# Altium project xDAC-v3.PrjPcb (part 1 of 7)
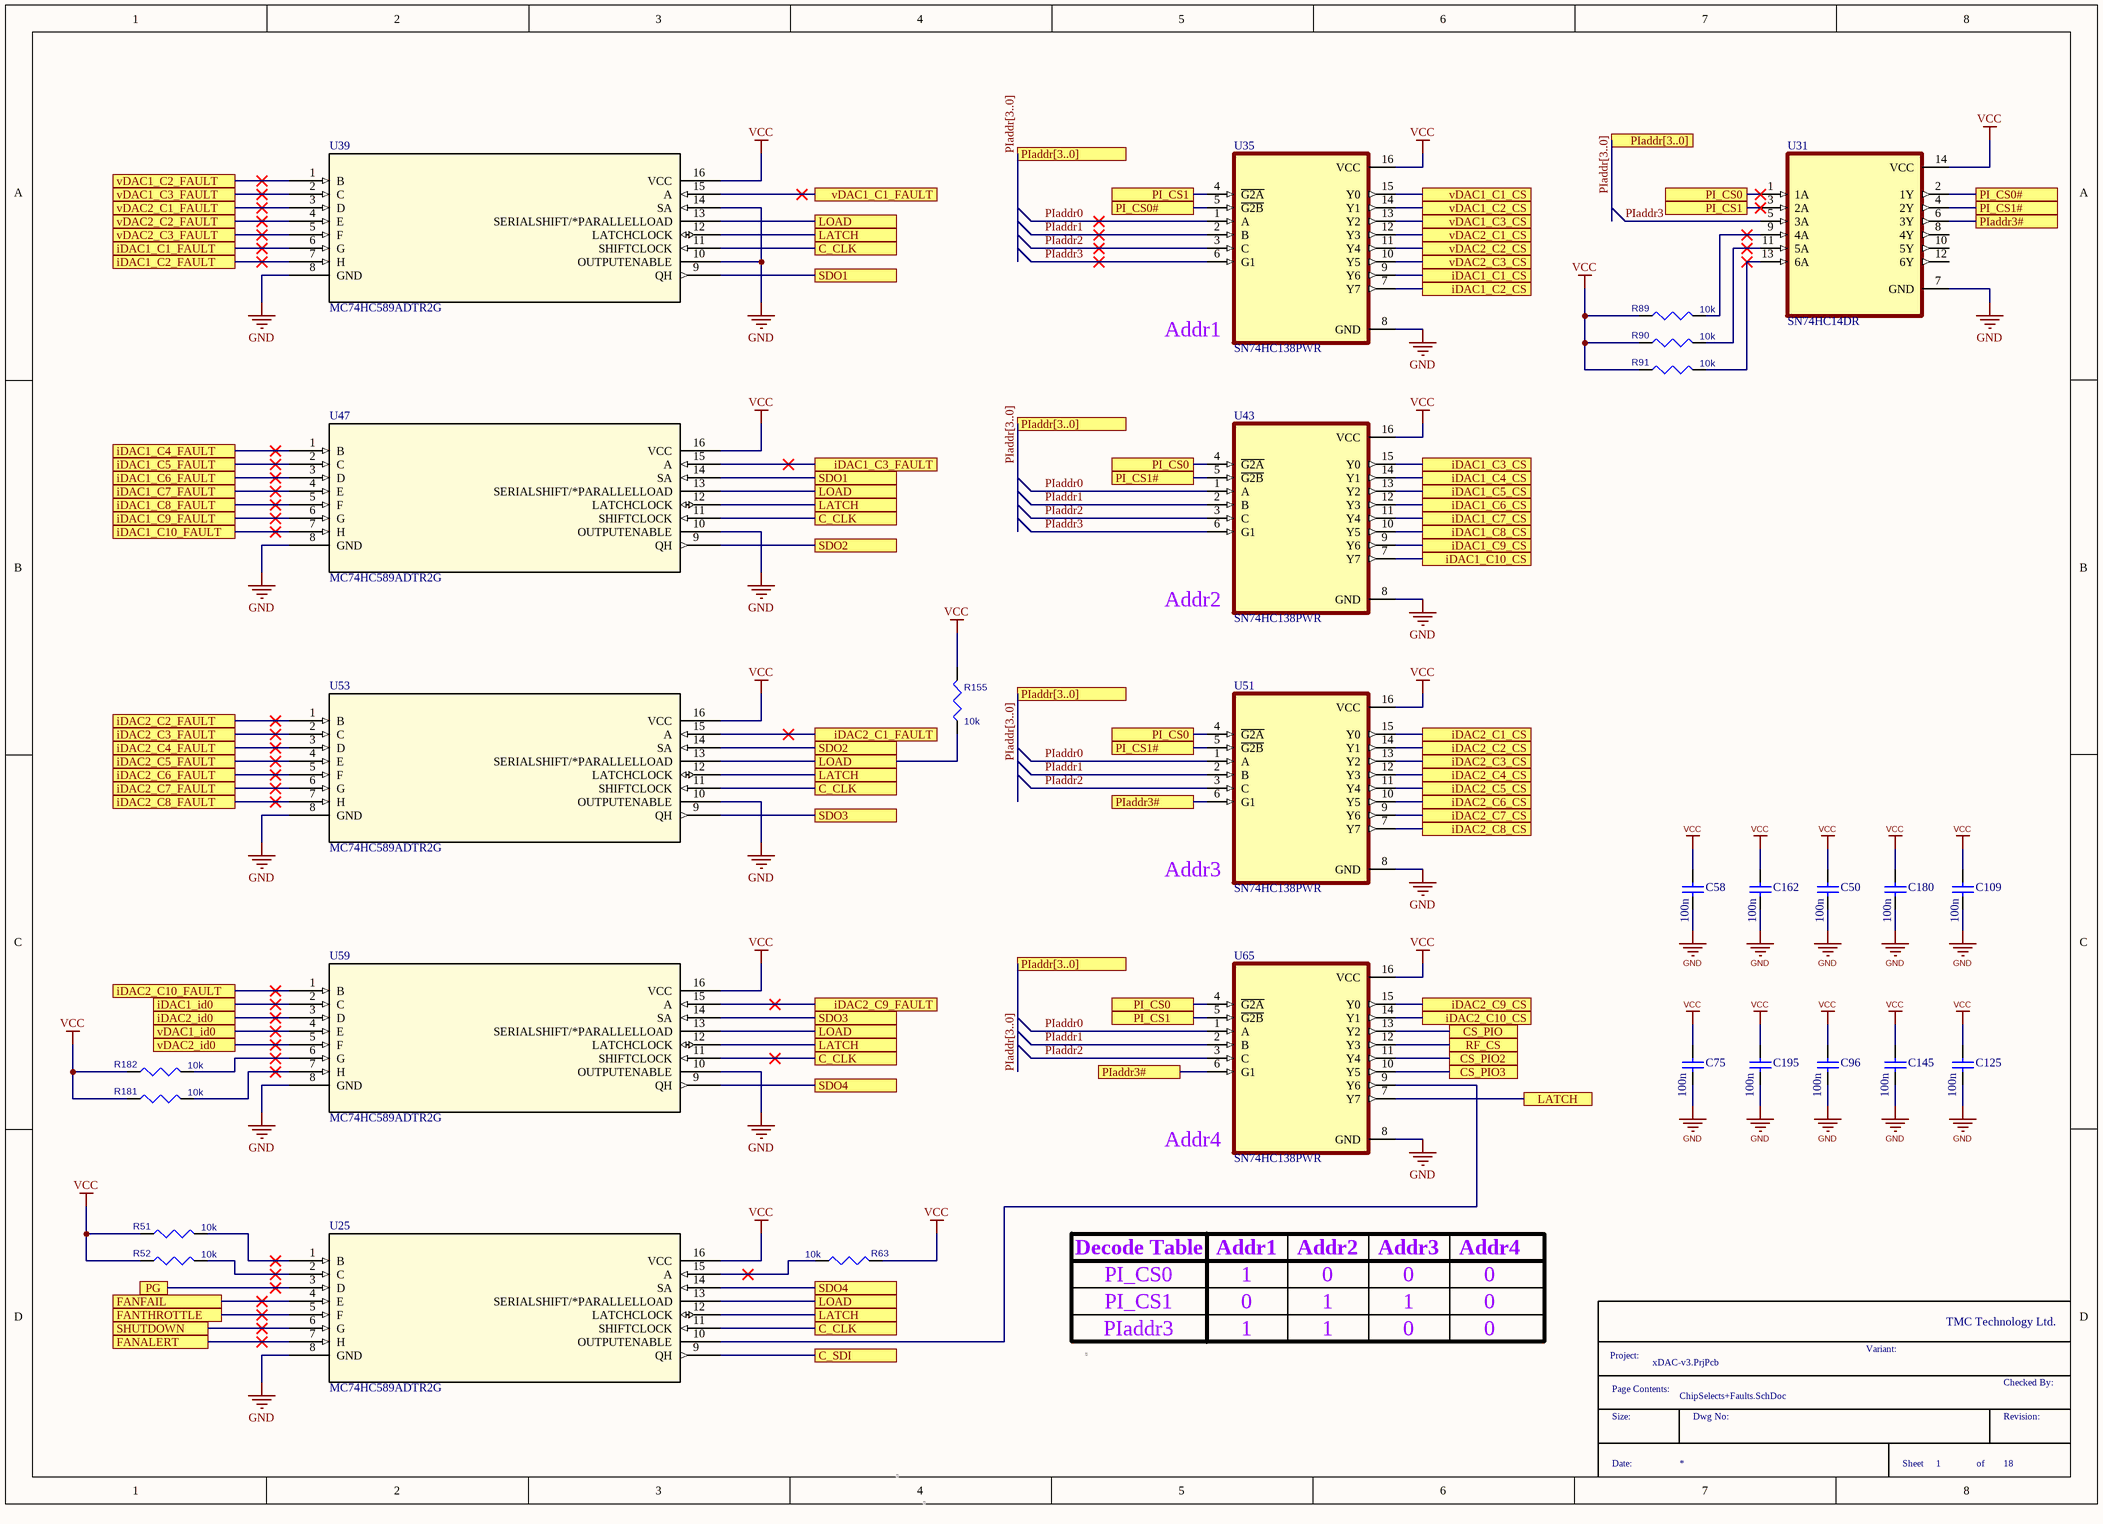
[diagram p0: ChipSelects+Faults.SchDoc]
18 sheets, 695 parts. Net scope: flat (ports and power ports of the same name join across sheets).
Board file: xDAC_Carrier-V3.PcbDoc
Sheets:
  ChipSelects+Faults.SchDoc
  Fan & Power Out.SchDoc
  iDAC1.SchDoc
  iDAC2.SchDoc
  LIM+LEDS+POWER.SchDoc
  PI_INTERFACE.SchDoc
  PIO.SchDoc
  Power.SchDoc
  RX_FlexiConnectors.SchDoc
  TEC_CONTROLLER_1.SchDoc
  TEC_CONTROLLER_2.SchDoc
  TEC_CONTROLLER_3.SchDoc
  TX_FlexiConnectors.SchDoc
  vDAC1.SchDoc
  vDAC2.SchDoc
  ADC-DAC.SchDoc
  PIC closed loop.SchDoc
  PD.SchDoc

## Sheet ChipSelects+Faults.SchDoc: Laser PCB
size A3; DrawnBy: James Singleton; Organization: TMC Technology Ltd.; DocumentNumber: 1; Revision: A; SheetNumber: 1; SheetTotal: 18; Drawn Date: 22/12/2020

### Parts
C50  100n  [CAPC1608X90X35LL15T15]
C58  100n  [CAPC1608X90X35LL15T15]
C75  100n  [CAPC1608X90X35LL15T15]
C96  100n  [CAPC1608X90X35LL15T15]
C109  100n  [CAPC1608X90X35LL15T15]
C125  100n  [CAPC1608X90X35LL15T15]
C145  100n  [CAPC1608X90X35LL15T15]
C162  100n  [CAPC1608X90X35LL15T15]
C180  100n  [CAPC1608X90X35LL15T15]
C195  100n  [CAPC1608X90X35LL15T15]
R51  value 10k  [CR0603N]  (hidden comment: RES)
R52  value 10k  [CR0603N]  (hidden comment: RES)
R63  value 10k  [CR0603N]  (hidden comment: RES)
R89  value 10k  [CR0603N]  (hidden comment: RES)
R90  value 10k  [CR0603N]  (hidden comment: RES)
R91  value 10k  [CR0603N]  (hidden comment: RES)
R155  value 10k  [CR0603N]  (hidden comment: RES)
R181  value 10k  [CR0603N]  (hidden comment: RES)
R182  value 10k  [CR0603N]  (hidden comment: RES)
U25  MC74HC589ADTR2G  [TSSOP-16_ONS]
U31  SN74HC14DR  [SOIC127P600X175-14N]
U35  SN74HC138PWR  [SOP65P640X120-16N]
U39  MC74HC589ADTR2G  [TSSOP-16_ONS]
U43  SN74HC138PWR  [SOP65P640X120-16N]
U47  MC74HC589ADTR2G  [TSSOP-16_ONS]
U51  SN74HC138PWR  [SOP65P640X120-16N]
U53  MC74HC589ADTR2G  [TSSOP-16_ONS]
U59  MC74HC589ADTR2G  [TSSOP-16_ONS]
U65  SN74HC138PWR  [SOP65P640X120-16N]

### Ports
C_CLK (see ChipSelects+Faults[4A], ChipSelects+Faults[4B], ChipSelects+Faults[4C], ChipSelects+Faults[4D], LIM+LEDS+POWER[8A], PI_INTERFACE[1B], PI_INTERFACE[4C], PIO[3B], PIO[3D], PIO[6B], PIO[6C]), C_CLK (see ChipSelects+Faults[4A], ChipSelects+Faults[4B], ChipSelects+Faults[4C], LIM+LEDS+POWER[8A], PI_INTERFACE[1B], PI_INTERFACE[4C], PIO[3B], PIO[3D], PIO[6B], PIO[6C]), C_CLK (see ChipSelects+Faults[4A], ChipSelects+Faults[4C], ChipSelects+Faults[4D], LIM+LEDS+POWER[8A], PI_INTERFACE[1B], PI_INTERFACE[4C], PIO[3B], PIO[3D], PIO[6B], PIO[6C]), C_CLK (see ChipSelects+Faults[4B], ChipSelects+Faults[4C], ChipSelects+Faults[4D], LIM+LEDS+POWER[8A], PI_INTERFACE[1B], PI_INTERFACE[4C], PIO[3B], PIO[3D], PIO[6B], PIO[6C]), C_SDI (see LIM+LEDS+POWER[8A], PI_INTERFACE[1B], PI_INTERFACE[4C], PIO[3B], PIO[3D], PIO[6B], PIO[6C]), CS_PIO2 (see PIO[6C]), CS_PIO3 (see PIO[3A]), CS_PIO (see PIO[6B]), FANALERT (see Fan & Power Out[6A]), FANFAIL (see Fan & Power Out[3A]), FANTHROTTLE (see Fan & Power Out[3B]), iDAC1_C1_CS (see iDAC1[4A]), iDAC1_C1_FAULT (see iDAC1[4A]), iDAC1_C2_CS (see iDAC1[4A]), iDAC1_C2_FAULT (see iDAC1[4B]), iDAC1_C3_CS (see iDAC1[4B]), iDAC1_C3_FAULT (see iDAC1[4B]), iDAC1_C4_CS (see iDAC1[4B]), iDAC1_C4_FAULT (see iDAC1[4B]), iDAC1_C5_CS (see iDAC1[4B]), iDAC1_C5_FAULT (see iDAC1[4C]), iDAC1_C6_CS (see iDAC1[6A]), iDAC1_C6_FAULT (see iDAC1[6A]), iDAC1_C7_CS (see iDAC1[6A]), iDAC1_C7_FAULT (see iDAC1[6B]), iDAC1_C8_CS (see iDAC1[6B]), iDAC1_C8_FAULT (see iDAC1[6B]), iDAC1_C9_CS (see iDAC1[6B]), iDAC1_C9_FAULT (see iDAC1[6B]), iDAC1_C10_CS (see iDAC1[6B]), iDAC1_C10_FAULT (see iDAC1[6C]), iDAC1_id0 (see iDAC1[4C], iDAC1[6D]), iDAC2_C1_CS (see iDAC2[4A]), iDAC2_C1_FAULT (see iDAC2[4B]), iDAC2_C2_CS (see iDAC2[4B]), iDAC2_C2_FAULT (see iDAC2[4B]), iDAC2_C3_CS (see iDAC2[4B]), iDAC2_C3_FAULT (see iDAC2[4B]), iDAC2_C4_CS (see iDAC2[4C]), iDAC2_C4_FAULT (see iDAC2[4C]), iDAC2_C5_CS (see iDAC2[4C]), iDAC2_C5_FAULT (see iDAC2[4C]), iDAC2_C6_CS (see iDAC2[6A]), iDAC2_C6_FAULT (see iDAC2[6B]), iDAC2_C7_CS (see iDAC2[6B]), iDAC2_C7_FAULT (see iDAC2[6B]), iDAC2_C8_CS (see iDAC2[6B]), iDAC2_C8_FAULT (see iDAC2[6B]), iDAC2_C9_CS (see iDAC2[6C]), iDAC2_C9_FAULT (see iDAC2[6C]), iDAC2_C10_CS (see iDAC2[6C]), iDAC2_C10_FAULT (see iDAC2[6C]), iDAC2_id0 (see iDAC2[2C], iDAC2[4C]), LATCH (see ChipSelects+Faults[4A], ChipSelects+Faults[4B], ChipSelects+Faults[4C], ChipSelects+Faults[4D]), LATCH (see ChipSelects+Faults[4A], ChipSelects+Faults[4B], ChipSelects+Faults[4C], ChipSelects+Faults[4D], ChipSelects+Faults[6C]), LATCH (see ChipSelects+Faults[4A], ChipSelects+Faults[4B], ChipSelects+Faults[4C], ChipSelects+Faults[6C]), LATCH (see ChipSelects+Faults[4A], ChipSelects+Faults[4C], ChipSelects+Faults[4D], ChipSelects+Faults[6C]), LATCH (see ChipSelects+Faults[4B], ChipSelects+Faults[4C], ChipSelects+Faults[4D], ChipSelects+Faults[6C]), LOAD (see ChipSelects+Faults[4A], ChipSelects+Faults[4B], ChipSelects+Faults[4C]), LOAD (see ChipSelects+Faults[4A], ChipSelects+Faults[4B], ChipSelects+Faults[4C], ChipSelects+Faults[4D]), LOAD (see ChipSelects+Faults[4A], ChipSelects+Faults[4C], ChipSelects+Faults[4D]), LOAD (see ChipSelects+Faults[4B], ChipSelects+Faults[4C], ChipSelects+Faults[4D]), PG (see Power[7A]), PI_CS0 (see ChipSelects+Faults[5B], ChipSelects+Faults[5C], ChipSelects+Faults[7A], PI_INTERFACE[5B]), PI_CS0 (see ChipSelects+Faults[5B], ChipSelects+Faults[5C], PI_INTERFACE[5B]), PI_CS0 (see ChipSelects+Faults[5B], ChipSelects+Faults[7A], PI_INTERFACE[5B]), PI_CS0# (see ChipSelects+Faults[5A]), PI_CS0# (see ChipSelects+Faults[8A]), PI_CS1 (see ChipSelects+Faults[5A], ChipSelects+Faults[5C], PI_INTERFACE[5B]), PI_CS1 (see ChipSelects+Faults[5A], ChipSelects+Faults[7A], PI_INTERFACE[5B]), PI_CS1 (see ChipSelects+Faults[5C], ChipSelects+Faults[7A], PI_INTERFACE[5B]), PI_CS1# (see ChipSelects+Faults[5B]), PI_CS1# (see ChipSelects+Faults[5B], ChipSelects+Faults[8A]), PIaddr3# (see ChipSelects+Faults[5C]), PIaddr3# (see ChipSelects+Faults[5C], ChipSelects+Faults[8A]), PIaddr[3..0] (see ChipSelects+Faults[4A], ChipSelects+Faults[4B], ChipSelects+Faults[4C], ChipSelects+Faults[7A], PI_INTERFACE[3C]), PIaddr[3..0] (see ChipSelects+Faults[4A], ChipSelects+Faults[4B], ChipSelects+Faults[4C], PI_INTERFACE[3C]), PIaddr[3..0] (see ChipSelects+Faults[4A], ChipSelects+Faults[4B], ChipSelects+Faults[7A], PI_INTERFACE[3C]), PIaddr[3..0] (see ChipSelects+Faults[4B], ChipSelects+Faults[4C], ChipSelects+Faults[7A], PI_INTERFACE[3C]), RF_CS (see LIM+LEDS+POWER[8A]), SDO1 (see ChipSelects+Faults[4A]), SDO1 (see ChipSelects+Faults[4B]), SDO2 (see ChipSelects+Faults[4B]), SDO3 (see ChipSelects+Faults[4C]), SDO4 (see ChipSelects+Faults[4C]), SDO4 (see ChipSelects+Faults[4D]), SHUTDOWN (see Fan & Power Out[3B]), vDAC1_C1_CS (see vDAC1[3A]), vDAC1_C1_FAULT (see vDAC1[3B]), vDAC1_C2_CS (see vDAC1[5A]), vDAC1_C2_FAULT (see vDAC1[5B]), vDAC1_C3_CS (see vDAC1[3B]), vDAC1_C3_FAULT (see vDAC1[3C]), vDAC1_id0 (see vDAC1[2C], vDAC1[4C]), vDAC2_C1_CS (see vDAC2[3A]), vDAC2_C1_FAULT (see vDAC2[3B]), vDAC2_C2_CS (see vDAC2[5A]), vDAC2_C2_FAULT (see vDAC2[5B]), vDAC2_C3_CS (see vDAC2[3B]), vDAC2_C3_FAULT (see vDAC2[3C]), vDAC2_id0 (see vDAC2[2C], vDAC2[4C])

### Nets
GND: C50.2 C58.2 C75.2 C96.2 C109.2 C125.2 C145.2 C162.2 C180.2 C195.2 U25.8(GND) U31.7(GND) U35.8(GND) U39.8(GND) U39.10(OUTPUTENABLE) U39.14(SA) U43.8(GND) U47.8(GND) U47.10(OUTPUTENABLE) U51.8(GND) U53.8(GND) U53.10(OUTPUTENABLE) U59.8(GND) U59.10(OUTPUTENABLE) U65.8(GND)
VCC: C50.1 C58.1 C75.1 C96.1 C109.1 C125.1 C145.1 C162.1 C180.1 C195.1 R51.1 R52.1 R63.1 R89.1 R90.1 R91.1 R155.1 R181.1 R182.1 U25.16(VCC) U31.14(VCC) U35.16(VCC) U39.16(VCC) U43.16(VCC) U47.16(VCC) U51.16(VCC) U53.16(VCC) U59.16(VCC) U65.16(VCC)
C_CLK: U25.11(SHIFTCLOCK) U39.11(SHIFTCLOCK) U47.11(SHIFTCLOCK) U53.11(SHIFTCLOCK) U59.11(SHIFTCLOCK) ; port C_CLK
C_SDI: U25.9(QH) ; port C_SDI
CS_PIO: U65.13(Y2) ; port CS_PIO
CS_PIO2: U65.11(Y4) ; port CS_PIO2
CS_PIO3: U65.10(Y5) ; port CS_PIO3
FANALERT: U25.7(H) ; port FANALERT
FANFAIL: U25.4(E) ; port FANFAIL
FANTHROTTLE: U25.5(F) ; port FANTHROTTLE
iDAC1_C1_CS: U35.9(Y6) ; port iDAC1_C1_CS
iDAC1_C1_FAULT: U39.6(G) ; port iDAC1_C1_FAULT
iDAC1_C2_CS: U35.7(Y7) ; port iDAC1_C2_CS
iDAC1_C2_FAULT: U39.7(H) ; port iDAC1_C2_FAULT
iDAC1_C3_CS: U43.15(Y0) ; port iDAC1_C3_CS
iDAC1_C3_FAULT: U47.15(A) ; port iDAC1_C3_FAULT
iDAC1_C4_CS: U43.14(Y1) ; port iDAC1_C4_CS
iDAC1_C4_FAULT: U47.1(B) ; port iDAC1_C4_FAULT
iDAC1_C5_CS: U43.13(Y2) ; port iDAC1_C5_CS
iDAC1_C5_FAULT: U47.2(C) ; port iDAC1_C5_FAULT
iDAC1_C6_CS: U43.12(Y3) ; port iDAC1_C6_CS
iDAC1_C6_FAULT: U47.3(D) ; port iDAC1_C6_FAULT
iDAC1_C7_CS: U43.11(Y4) ; port iDAC1_C7_CS
iDAC1_C7_FAULT: U47.4(E) ; port iDAC1_C7_FAULT
iDAC1_C8_CS: U43.10(Y5) ; port iDAC1_C8_CS
iDAC1_C8_FAULT: U47.5(F) ; port iDAC1_C8_FAULT
iDAC1_C9_CS: U43.9(Y6) ; port iDAC1_C9_CS
iDAC1_C9_FAULT: U47.6(G) ; port iDAC1_C9_FAULT
iDAC1_C10_CS: U43.7(Y7) ; port iDAC1_C10_CS
iDAC1_C10_FAULT: U47.7(H) ; port iDAC1_C10_FAULT
iDAC1_id0: U59.2(C) ; port iDAC1_id0
iDAC2_C1_CS: U51.15(Y0) ; port iDAC2_C1_CS
iDAC2_C1_FAULT: U53.15(A) ; port iDAC2_C1_FAULT
iDAC2_C2_CS: U51.14(Y1) ; port iDAC2_C2_CS
iDAC2_C2_FAULT: U53.1(B) ; port iDAC2_C2_FAULT
iDAC2_C3_CS: U51.13(Y2) ; port iDAC2_C3_CS
iDAC2_C3_FAULT: U53.2(C) ; port iDAC2_C3_FAULT
iDAC2_C4_CS: U51.12(Y3) ; port iDAC2_C4_CS
iDAC2_C4_FAULT: U53.3(D) ; port iDAC2_C4_FAULT
iDAC2_C5_CS: U51.11(Y4) ; port iDAC2_C5_CS
iDAC2_C5_FAULT: U53.4(E) ; port iDAC2_C5_FAULT
iDAC2_C6_CS: U51.10(Y5) ; port iDAC2_C6_CS
iDAC2_C6_FAULT: U53.5(F) ; port iDAC2_C6_FAULT
iDAC2_C7_CS: U51.9(Y6) ; port iDAC2_C7_CS
iDAC2_C7_FAULT: U53.6(G) ; port iDAC2_C7_FAULT
iDAC2_C8_CS: U51.7(Y7) ; port iDAC2_C8_CS
iDAC2_C8_FAULT: U53.7(H) ; port iDAC2_C8_FAULT
iDAC2_C9_CS: U65.15(Y0) ; port iDAC2_C9_CS
iDAC2_C9_FAULT: U59.15(A) ; port iDAC2_C9_FAULT
iDAC2_C10_CS: U65.14(Y1) ; port iDAC2_C10_CS
iDAC2_C10_FAULT: U59.1(B) ; port iDAC2_C10_FAULT
iDAC2_id0: U59.3(D) ; port iDAC2_id0
LATCH: U25.12(LATCHCLOCK) U39.12(LATCHCLOCK) U47.12(LATCHCLOCK) U53.12(LATCHCLOCK) U59.12(LATCHCLOCK) U65.7(Y7) ; port LATCH
LOAD: R155.2 U25.13(SERIALSHIFT/*PARALLELLOAD) U39.13(SERIALSHIFT/*PARALLELLOAD) U47.13(SERIALSHIFT/*PARALLELLOAD) U53.13(SERIALSHIFT/*PARALLELLOAD) U59.13(SERIALSHIFT/*PARALLELLOAD) ; port LOAD
PG: U25.3(D) ; port PG
PI_CS0: U31.1(1A) U43.4(~{G2A}) U51.4(~{G2A}) U65.4(~{G2A}) ; port PI_CS0
PI_CS0#: U31.2(1Y) U35.5(~{G2B}) ; port PI_CS0#
PI_CS1: U31.3(2A) U35.4(~{G2A}) U65.5(~{G2B}) ; port PI_CS1
PI_CS1#: U31.4(2Y) U43.5(~{G2B}) U51.5(~{G2B}) ; port PI_CS1#
PIaddr0: U35.1(A) U43.1(A) U51.1(A) U65.1(A)
PIaddr1: U35.2(B) U43.2(B) U51.2(B) U65.2(B)
PIaddr2: U35.3(C) U43.3(C) U51.3(C) U65.3(C)
PIaddr3: U31.5(3A) U35.6(G1) U43.6(G1)
PIaddr3#: U31.6(3Y) U51.6(G1) U65.6(G1) ; port PIaddr3#
RF_CS: U65.12(Y3) ; port RF_CS
SDO1: U39.9(QH) U47.14(SA) ; port SDO1
SDO2: U47.9(QH) U53.14(SA) ; port SDO2
SDO3: U53.9(QH) U59.14(SA) ; port SDO3
SDO4: U25.14(SA) U59.9(QH) ; port SDO4
SHUTDOWN: U25.6(G) ; port SHUTDOWN
vDAC1_C1_CS: U35.15(Y0) ; port vDAC1_C1_CS
vDAC1_C1_FAULT: U39.15(A) ; port vDAC1_C1_FAULT
vDAC1_C2_CS: U35.14(Y1) ; port vDAC1_C2_CS
vDAC1_C2_FAULT: U39.1(B) ; port vDAC1_C2_FAULT
vDAC1_C3_CS: U35.13(Y2) ; port vDAC1_C3_CS
vDAC1_C3_FAULT: U39.2(C) ; port vDAC1_C3_FAULT
vDAC1_id0: U59.4(E) ; port vDAC1_id0
vDAC2_C1_CS: U35.12(Y3) ; port vDAC2_C1_CS
vDAC2_C1_FAULT: U39.3(D) ; port vDAC2_C1_FAULT
vDAC2_C2_CS: U35.11(Y4) ; port vDAC2_C2_CS
vDAC2_C2_FAULT: U39.4(E) ; port vDAC2_C2_FAULT
vDAC2_C3_CS: U35.10(Y5) ; port vDAC2_C3_CS
vDAC2_C3_FAULT: U39.5(F) ; port vDAC2_C3_FAULT
vDAC2_id0: U59.5(F) ; port vDAC2_id0
NetR51_2: R51.2 U25.1(B)
NetR52_2: R52.2 U25.2(C)
NetR63_2: R63.2 U25.15(A)
NetR89_2: R89.2 U31.9(4A)
NetR90_2: R90.2 U31.11(5A)
NetR91_2: R91.2 U31.13(6A)
NetR181_2: R181.2 U59.7(H)
NetR182_2: R182.2 U59.6(G)
NetU25_10: U25.10(OUTPUTENABLE) U65.9(Y6)

Not connected (* = marked no-connect by the designer): U31 8(4Y) 10(5Y) 12(6Y)

### Buses and harness runs
bus PIaddr[3..0] = port PIaddr[3..0]

### Notes on the sheet
- (near U35) Addr1
- (near U43) Addr2
- (near U51) Addr3
- (near U65) Addr4
- Decode Table
- PI_CS0
- Addr1
- 1
- Addr2
- 0
- Addr3
- Addr4
- PI_CS1
- PIaddr3
- TMC Technology Ltd.
- Page Contents:
- Project:
- Variant:
- Checked By:
- Size:
- Date:
- Dwg No:
- Sheet
- of
- Revision:

### Library data of the parts
C50 C58 C75 C96 C109 C125 C145 C162 C180 C195 = CMP-1035-02592-3: Chip Capacitor, 100 nF, +/- 10%, 50 V, -55 to 125 degC, 0603 (1608 Metric), RoHS, Tape and Reel; Manufacturer: KEMET; Manufacturer Part Number: C0603C104K5RACTU; Case\Package: 0603; Type (Capacitors): X7R; Capacitance: 100 nF; Voltage Rating: 50 V; Pins: 2; Max Operating Temperature: 125 degC; Min Operating Temperature: -55 degC; Case Code (Imperial): 0603; DatasheetVersion: 07/2016; Package Quantity: 4000; Length: 1.6 mm; REACH SVHC: No SVHC; Packaging: Tape and Reel; Case Code (Metric): 1608; Mounting Technology: Surface Mount; RoHSCompliant: true; Height: 0.9 mm; ComponentLink1URL: http://www.avx.com/; ComponentLink2URL: http://datasheets.avx.com/X7RDielectric.pdf; Mount: Surface Mount; ComponentLink2Description: Datasheet; Width: 0.81 mm; PackageReference: 0603; PackageDescription: 2-Pin Surface Mount Device, Body 1.6 x 0.81 mm; Radiation Hardening: No; ComponentLink1Description: Manufacturer URL; Voltage Rating (DC): 50 V; Tolerance: 10%; 8Vinv: *
R51 R52 R63 R89-R91 R155 R181 R182 = RES: RES.,10k OHMS,1%,1/10W,0603; Manufacturer_PN: ERJ3EKF1002V; Manufacturer: PANASONIC; Part No: P10.0KHCT-ND; CLASS: DISCRETE; Temperature_Coefficient: 100ppm/C; FPLIST: CR0603N,CR0603L,CR0603M; Source_Path: \\MIL-NS1\CIP\SCHEMATIC_SYMBOLS\LTC_RESISTOR.OLB; Geometry.Height: 37.40mil; PCB DECAL: CR0603N; Rated_Power: 1/10W; Tolerance: 1%; Package_Size: 0603
U25 U39 U47 U53 U59 = MC74HC589ADTR2G: No Description Available; Vendor: ON Semiconductor; SourceLibrary: ONSemi_2017-12-12_1; Manufacturer_Part_Number: MC74HC589ADTR2G; Copyright: Copyright (C) 2016 Accelerated Designs. All rights reserved; RefDes: RefDes; Type: DEV
U31 = SN74HC14DR: Hex Schmitt-Trigger Inverters 14-SOIC -40 to 85; MF: Texas Instruments; Arrow_Electronics-Purchase-URL: https://snapeda.com/shop?store=Arrow+Electronics&id=48244; DigiKey-Purchase-URL: https://snapeda.com/shop?store=DigiKey&id=48244; Package: SOIC-14 Texas Instruments; Digi-Key_Part_Number: 296-1194-1-ND; Value: *; Mouser-Purchase-URL: https://snapeda.com/shop?store=Mouser&id=48244; MP: SN74HC14DR; SnapEDA_Link: https://www.snapeda.com/parts/SN74HC14DR/Texas%20Instruments/view-part/48244/?ref=snap; Texas_Instruments-Purchase-URL: https://snapeda.com/shop?store=Texas+Instruments&id=48244; BuyPart: https://www.snapeda.com/parts/SN74HC14DR/Texas%20Instruments/view-part/48244/?ref=eda
U35 U43 U51 U65 = SN74HC138PWR: 3-Line To 8-Line Decoders/Demultiplexers 16-TSSOP -40 to 85; MF: Texas Instruments; Purchase-URL: https://pricing.snapeda.com/search/part/SN74HC138PWR/?ref=eda; Package: TSSOP-16 Texas Instruments; MP: SN74HC138PWR; Value: *; SnapEDA_Link: https://www.snapeda.com/parts/SN74HC138PWR/Texas%20Instruments/view-part/387913/?ref=snap; Price: None; Availability: Unavailable; Check_prices: https://www.snapeda.com/parts/SN74HC138PWR/Texas%20Instruments/view-part/387913/?ref=eda

## Sheet Fan & Power Out.SchDoc: Laser PCB
size A3; DrawnBy: James Singleton; Organization: TMC Technology Ltd.; DocumentNumber: 4; Revision: A; SheetNumber: 2; SheetTotal: 18; Drawn Date: 22/12/2020
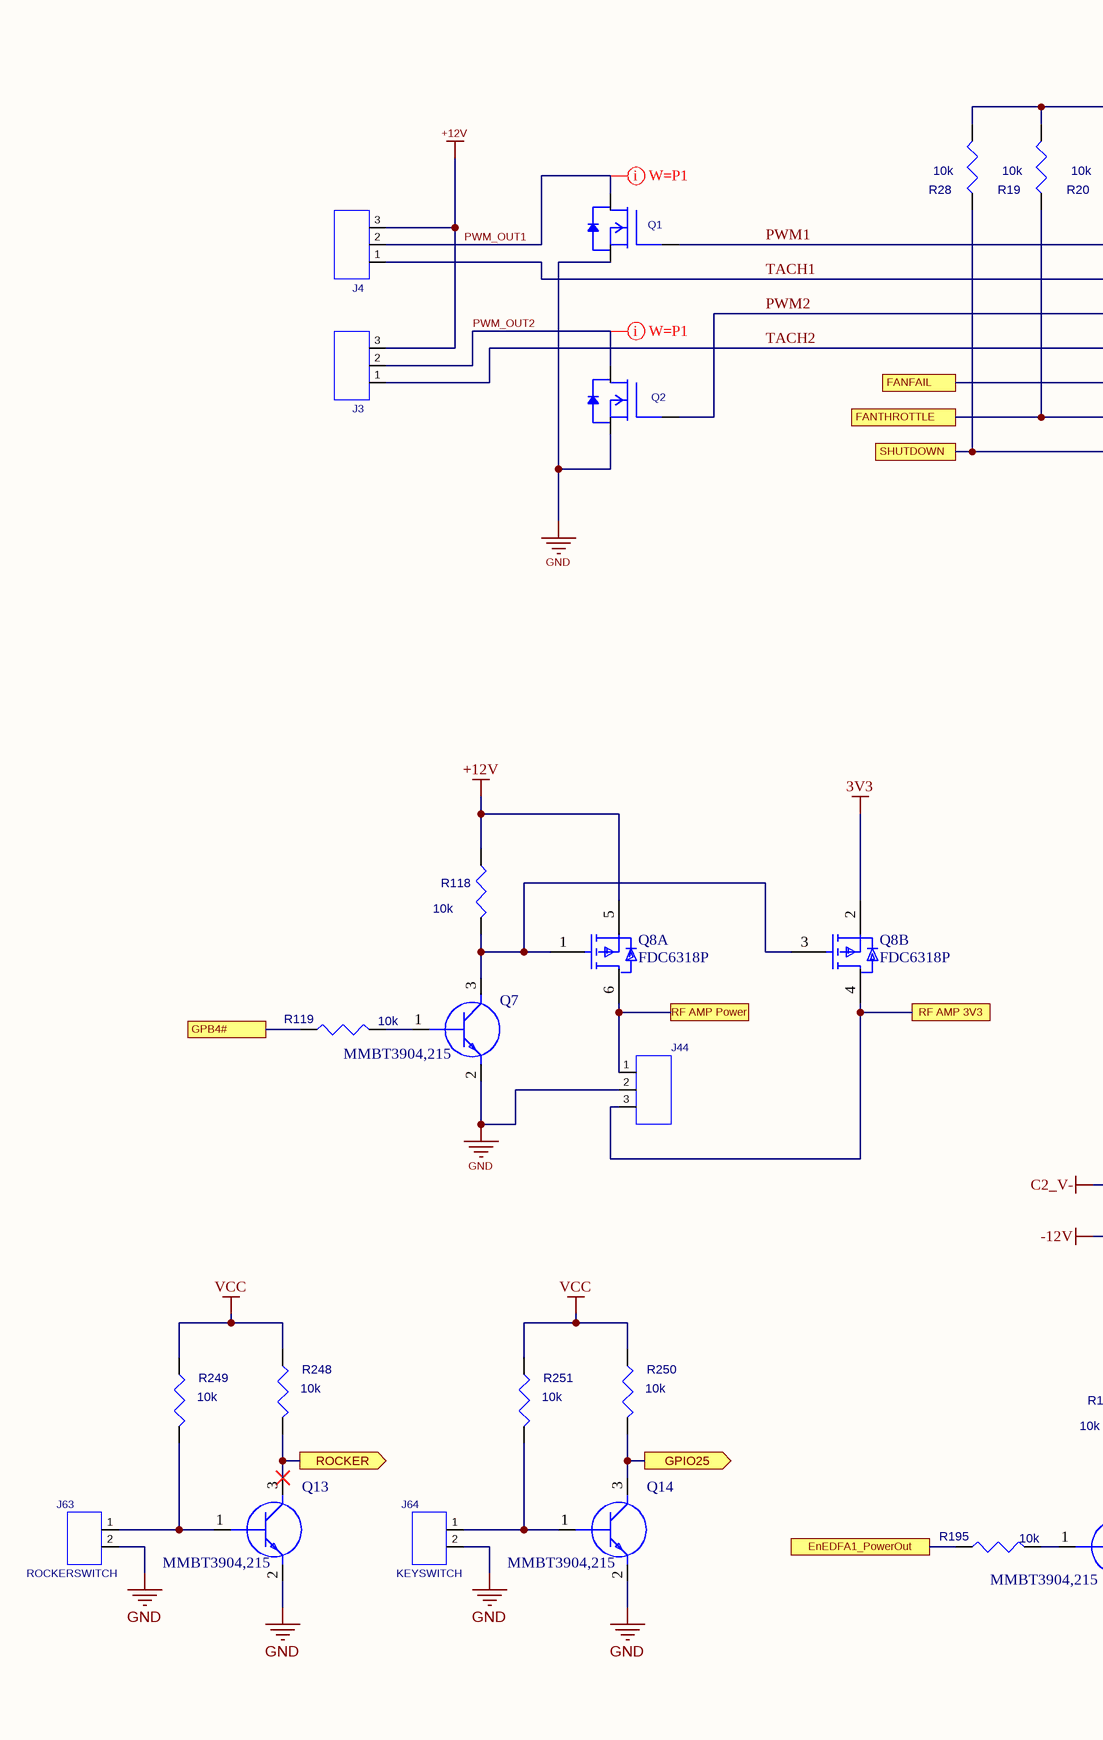
[diagram p1: Fan & Power Out.SchDoc, left]
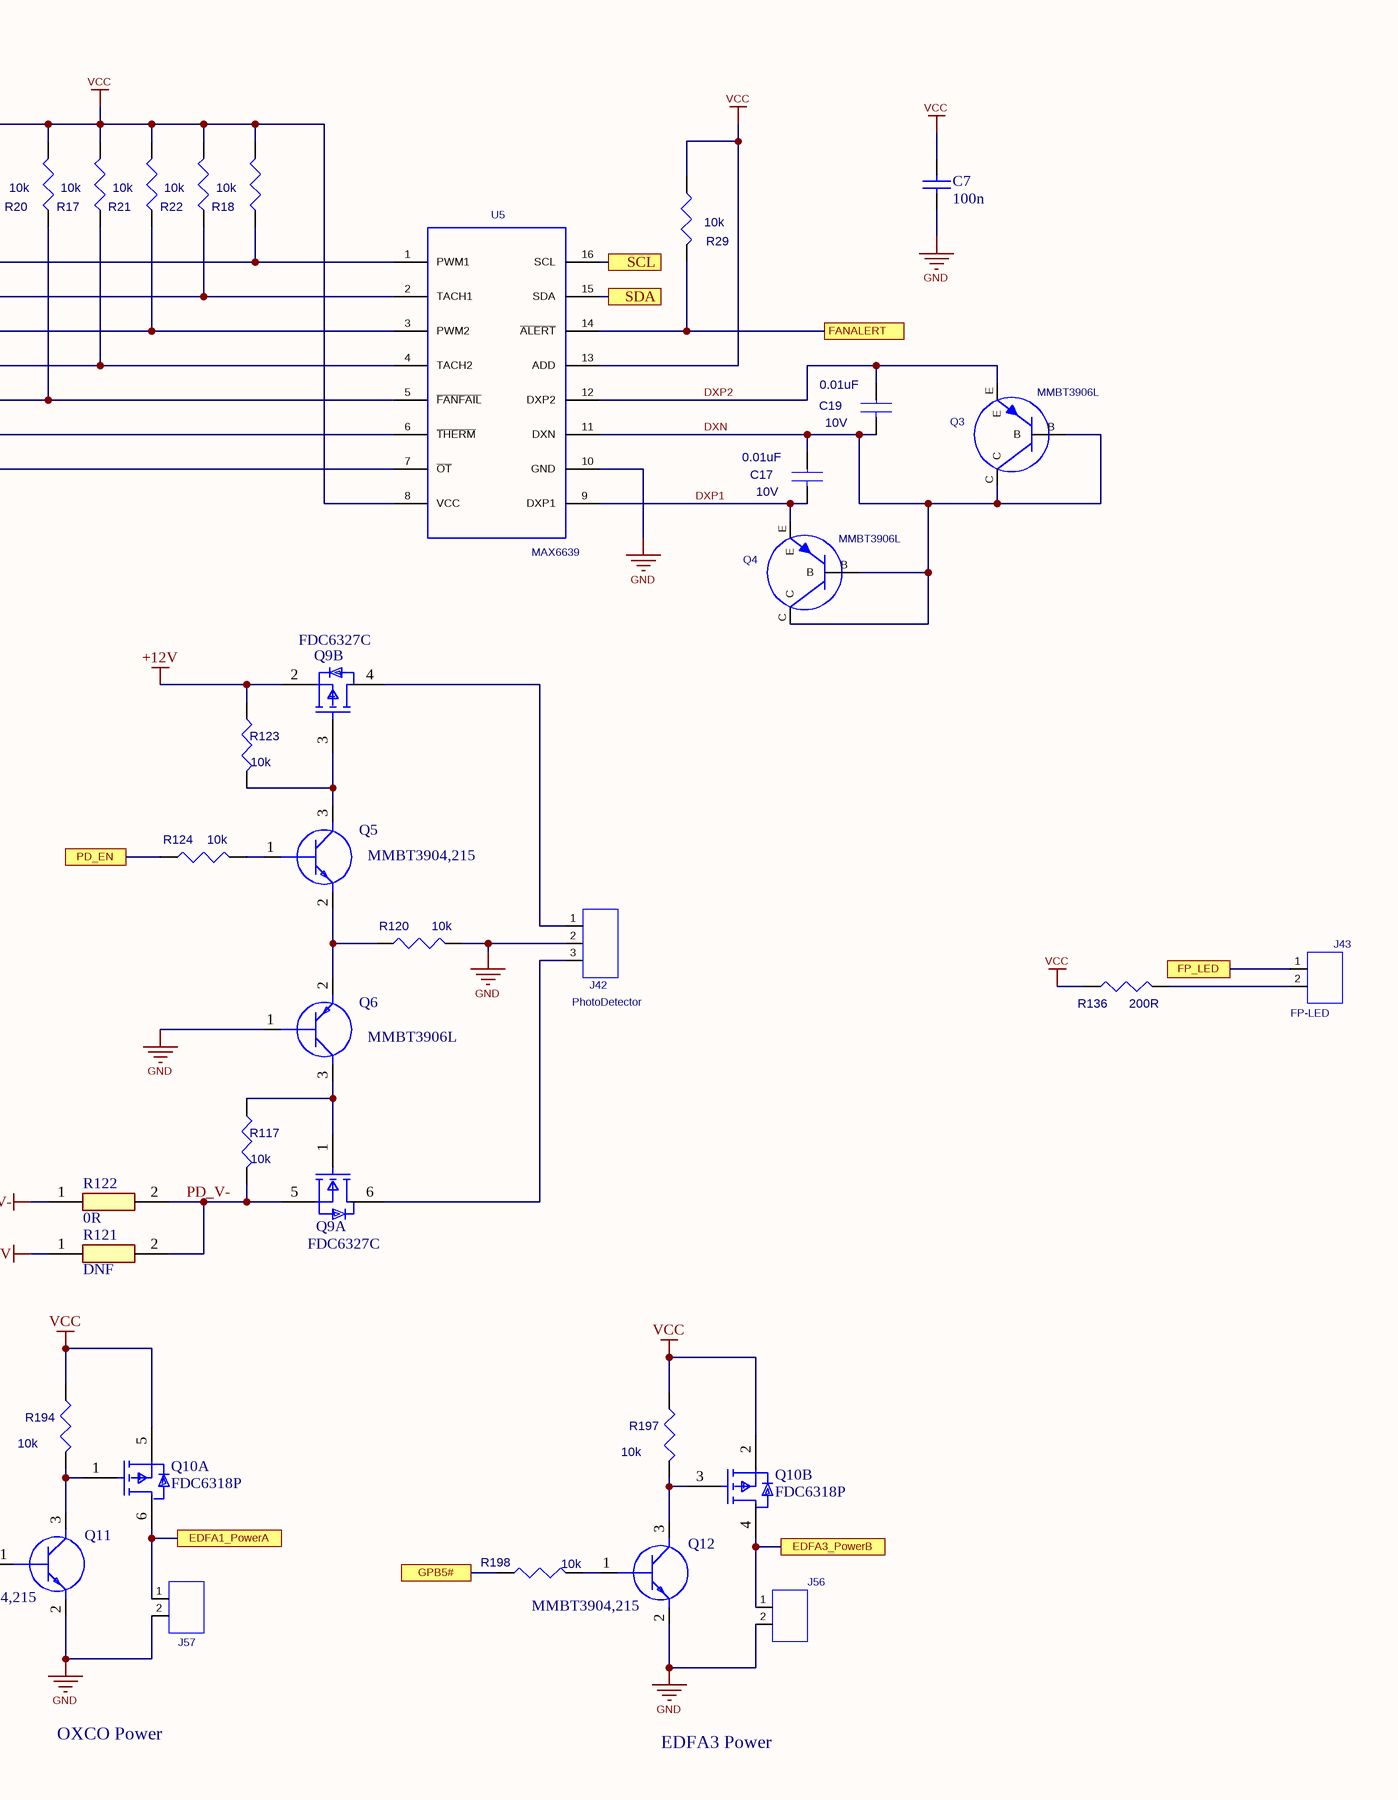
[diagram p2: Fan & Power Out.SchDoc, right]

### Parts
C7  100n  [CAPC1608X90X35LL15T15]
C17  value 0.01uF  Rated_Voltage: 10V  [CC0603N]  (hidden comment: CAP)
C19  value 0.01uF  Rated_Voltage: 10V  [CC0603N]  (hidden comment: CAP)
J3  CON03  [AE-6410-3W-VERTICAL]  (value not drawn)
J4  CON03  [AE-6410-3W-VERTICAL]  (value not drawn)
J42  PhotoDetector  [AE-6410-3W-VERTICAL]
J43  FP-LED  [AE-6410-2W-VERTICAL]
J44  CON03  [AE-6410-3W-VERTICAL]  (value not drawn)
J56  EDFA3 Power  [AE-6410-2W-VERTICAL]
J57  OXCO Power  [AE-6410-2W-VERTICAL]
J63  ROCKERSWITCH  [AE-6410-2W-VERTICAL]
J64  KEYSWITCH  [AE-6410-2W-VERTICAL]
Q1  DMG3418L-7  [SOT95P240X110-3N]  (value not drawn)
Q2  DMG3418L-7  [SOT95P240X110-3N]  (value not drawn)
Q3  MMBT3906L  [MMBT3906L]
Q4  MMBT3906L  [MMBT3906L]
Q5  MMBT3904,215  [MMBT3904215]
Q6  MMBT3906L  [SOT96P237X111-3N]
Q7  MMBT3904,215  [MMBT3904215]
Q8  FDC6318P  [ON_Semi_419BL_0]  (parts A,B of 2)
Q9  FDC6327C  [SOT95P275X110-6N]  (parts A,B of 2)
Q10  FDC6318P  [ON_Semi_419BL_0]  (parts A,B of 2)
Q11  MMBT3904,215  [MMBT3904215]
Q12  MMBT3904,215  [MMBT3904215]
Q13  MMBT3904,215  [MMBT3904215]
Q14  MMBT3904,215  [MMBT3904215]
R17  value 10k  [CR0603N]  (hidden comment: RES)
R18  value 10k  [CR0603N]  (hidden comment: RES)
R19  value 10k  [CR0603N]  (hidden comment: RES)
R20  value 10k  [CR0603N]  (hidden comment: RES)
R21  value 10k  [CR0603N]  (hidden comment: RES)
R22  value 10k  [CR0603N]  (hidden comment: RES)
R28  value 10k  [CR0603N]  (hidden comment: RES)
R29  value 10k  [CR0603N]  (hidden comment: RES)
R117  value 10k  [CR0603N]  (hidden comment: RES)
R118  value 10k  [CR0603N]  (hidden comment: RES)
R119  value 10k  [CR0603N]  (hidden comment: RES)
R120  value 10k  [CR0603N]  (hidden comment: RES)
R121  value DNF  [RESC1608X55N]
R122  value 0R  [RESC1608X55N]
R123  value 10k  [CR0603N]  (hidden comment: RES)
R124  value 10k  [CR0603N]  (hidden comment: RES)
R136  value 200R  [CR0603N]  (hidden comment: RES)
R194  value 10k  [CR0603N]  (hidden comment: RES)
R195  value 10k  [CR0603N]  (hidden comment: RES)
R197  value 10k  [CR0603N]  (hidden comment: RES)
R198  value 10k  [CR0603N]  (hidden comment: RES)
R248  value 10k  [CR0603N]  (hidden comment: RES)
R249  value 10k  [CR0603N]  (hidden comment: RES)
R250  value 10k  [CR0603N]  (hidden comment: RES)
R251  value 10k  [CR0603N]  (hidden comment: RES)
U5  MAX6639  [SOP63P602X173-16N]

### Ports
EDFA1_PowerA (see PIO[1A], PIO[2A]), EDFA3_PowerB (see PIO[1B], PIO[1C], PIO[2B], PIO[2C]), EnEDFA1_PowerOut (see PIO[2C]), FANALERT (see ChipSelects+Faults[1D]), FANFAIL (see ChipSelects+Faults[1D]), FANTHROTTLE (see ChipSelects+Faults[1D]), FP_LED (see PI_INTERFACE[3A]), GPB4# (see PIO[2C]), GPB5# (see PIO[2C]), GPIO25 (out, see PI_INTERFACE[5B]), PD_EN (see PIO[7B]), RF AMP 3V3, RF AMP Power, ROCKER (out, see PI_INTERFACE[3A]), SCL (see ADC-DAC[2C], ADC-DAC[3A], ADC-DAC[4B], ADC-DAC[4C], ADC-DAC[5C], ADC-DAC[6A], PI_INTERFACE[3A], TEC_CONTROLLER_1[6B], TEC_CONTROLLER_1[7A], TEC_CONTROLLER_1[8B]), SDA (see ADC-DAC[2C], ADC-DAC[3A], ADC-DAC[4B], ADC-DAC[4C], ADC-DAC[5C], ADC-DAC[6A], PI_INTERFACE[3A], TEC_CONTROLLER_1[6B], TEC_CONTROLLER_1[7A], TEC_CONTROLLER_1[7B]), SHUTDOWN (see ChipSelects+Faults[1D])

### Nets
3V3: Q8.2(S2)
+12V: J3.3 J4.3 Q8.5(S1) Q9.2(S2) R118.1 R123.1
-12V: R121.1
C2_V-: R122.1
GND: C7.2 J42.2 J44.2 J56.2 J57.2 J63.2 J64.2 Q1.2 Q2.2 Q6.1(B) Q7.2(E) Q11.2(E) Q12.2(E) Q13.2(E) Q14.2(E) R120.2 U5.10(GND)
VCC: C7.1 Q10.2(S2) Q10.5(S1) R17.2 R18.2 R19.2 R20.2 R21.2 R22.2 R28.2 R29.2 R136.1 R194.1 R197.1 R248.1 R249.1 R250.1 R251.1 U5.8(VCC) U5.13(ADD)
DXN: C17.1 C19.2 Q3.B Q3.C Q4.B Q4.C U5.11(DXN)
DXP1: C17.2 Q4.E U5.9(DXP1)
DXP2: C19.1 Q3.E U5.12(DXP2)
EDFA1_PowerA: J57.1 Q10.6(D1) ; port EDFA1_PowerA
EDFA3_PowerB: J56.1 Q10.4(D2) ; port EDFA3_PowerB
EnEDFA1_PowerOut: R195.1 ; port EnEDFA1_PowerOut
FANALERT: R29.1 U5.14(~{ALERT}) ; port FANALERT
FANFAIL: R20.1 U5.5(~{FANFAIL}) ; port FANFAIL
FANTHROTTLE: R19.1 U5.6(~{THERM}) ; port FANTHROTTLE
FP_LED: J43.1 ; port FP_LED
GPB4#: R119.1 ; port GPB4#
GPB5#: R198.1 ; port GPB5#
GPIO25: Q14.3(C) R250.2 ; port GPIO25
PD_EN: R124.1 ; port PD_EN
PD_V-: Q9.5(S2) R117.2 R121.2 R122.2
PWM1: Q1.1 R18.1 U5.1(PWM1)
PWM2: Q2.1 R21.1 U5.3(PWM2)
PWM_OUT1: J4.2 Q1.3
PWM_OUT2: J3.2 Q2.3
RF AMP 3V3: J44.3 Q8.4(D2) ; port RF AMP 3V3
RF AMP Power: J44.1 Q8.6(D1) ; port RF AMP Power
ROCKER: Q13.3(C) R248.2 ; port ROCKER
SCL: U5.16(SCL) ; port SCL
SDA: U5.15(SDA) ; port SDA
SHUTDOWN: R28.1 U5.7(~{OT}) ; port SHUTDOWN
TACH1: J4.1 R22.1 U5.2(TACH1)
TACH2: J3.1 R17.1 U5.4(TACH2)
NetJ42_1: J42.1 Q9.4(D2)
NetJ42_3: J42.3 Q9.6(D2)
NetJ43_2: J43.2 R136.2
NetJ63_1: J63.1 Q13.1(B) R249.2
NetJ64_1: J64.1 Q14.1(B) R251.2
NetQ5_1: Q5.1(B) R124.2
NetQ5_2: Q5.2(E) Q6.2(E) R120.1
NetQ5_3: Q5.3(C) Q9.3(G2) R123.2
NetQ6_3: Q6.3(C) Q9.1(G2) R117.1
NetQ7_1: Q7.1(B) R119.2
NetQ7_3: Q7.3(C) Q8.1(G1) Q8.3(G2) R118.2
NetQ10_1: Q10.1(G1) Q11.3(C) R194.2
NetQ10_3: Q10.3(G2) Q12.3(C) R197.2
NetQ11_1: Q11.1(B) R195.2
NetQ12_1: Q12.1(B) R198.2

### Layout directives
mark named W=P1: PWM_OUT1, PWM_OUT2

### Notes on the sheet
- TMC Technology Ltd.
- Page Contents:
- Project:
- Variant:
- Checked By:
- Size:
- Date:
- Dwg No:
- Sheet
- of
- Revision:

### Library data of the parts
C7 = CMP-1035-02592-3: as C50 on sheet ChipSelects+Faults; Pins: 2; Max Operating Temperature: 125 degC; Min Operating Temperature: -55 degC; Case Code (Imperial): 0603; DatasheetVersion: 07/2016; Package Quantity: 4000; Length: 1.6 mm; REACH SVHC: No SVHC; Packaging: Tape and Reel; Case Code (Metric): 1608; Mounting Technology: Surface Mount; RoHSCompliant: true; Height: 0.9 mm; ComponentLink1URL: http://www.avx.com/; ComponentLink2URL: http://datasheets.avx.com/X7RDielectric.pdf; Mount: Surface Mount; ComponentLink2Description: Datasheet; Width: 0.81 mm; PackageReference: 0603; PackageDescription: 2-Pin Surface Mount Device, Body 1.6 x 0.81 mm; Radiation Hardening: No; ComponentLink1Description: Manufacturer URL; Voltage Rating (DC): 50 V; Tolerance: 10%; 8Vinv: *
C17 C19 = CAP: CAP.,0.01uF,X5R,10V,10%,0603; Manufacturer: AVX; Manufacturer_PN: 0603ZD103KAT2A; FPLIST: CC0603N,CC0603L,CC0603M; CLASS: DISCRETE; Source_Path: \\MIL-NS1\CIP\SCHEMATIC_SYMBOLS\LTC_CAPACITOR.OLB; Geometry.Height: 37.40mil; Package_Size: 0603; Dielectric_Type: X5R; Tolerance: 10%; PCB DECAL: CC0603N
J3 J4 J42 = CON03: 3 pin Connector; MANUFACTURER1: ADIMPEX (Cod.  LE008003-R); Manufacturer: Molex; VALUE: STRIP1X3VM; SPEA DEVICE CODE: 700; PTEXT3: 3; PTEXT2: 2; PTEXT1: 1; Geometry.Height: 400 mil; UNNAMED1: DNF; Order No: 1360131; VAL: *; TOL: *; NTOL: *; MANUFACTURER2: Molex ( Cod. 22-03-2031 ); DEVICE TYPE: Connector; CASE TYPE: TH; PCB DECAL: AE-6410-3W-VERTICAL; Part No: 22-29-2031; System: Connector
J43 J63 J64 = CON02: 2 pin Connector, straight header, 2.54mm pitch; Part No: 2211S-02G; Manufacturer: Multicomp; Order No: 1593411; PCB DECAL: AE-6410-2W-VERTICAL
J44 = CON03: 3 pin Connector; Manufacturer: Molex; MANUFACTURER1: ADIMPEX (Cod.  LE008003-R); UNNAMED1: DNF; Order No: 1360131; VALUE: STRIP1X3VM; SPEA DEVICE CODE: 700; PTEXT3: 3; PTEXT2: 2; PTEXT1: 1; Geometry.Height: 400 mil; PCB DECAL: AE-6410-3W-VERTICAL; Part No: 22-29-2031; System: Connector; VAL: *; TOL: *; NTOL: *; MANUFACTURER2: Molex ( Cod. 22-03-2031 ); DEVICE TYPE: Connector; CASE TYPE: TH
J56 J57 = CON02: 2 pin Connector; Manufacturer: Molex; UNNAMED1: DNF; Order No: 1360130; PCB DECAL: AE-6410-2W-VERTICAL; Part No: 22-29-2021; System: Connector
Q1 Q2 = DMG3418L-7: MOSFET N-CH 30V 4A SOT23; Manufacturer: Diodes Inc; Geometry.Height: 1.1mm; Order No: 3276189; Part No: DMG3418L-7; PCB DECAL: SOT95P240X110-3N
Q3 Q4 = MMBT3906L: GENERAL PURPOSE PNP SILICON TRANSISTOR; Part Number: MMBT3906LT1G; Manufacturer #1: On Semiconductor; Manufacturer: On Semi; Order No: MMBT3906LT1GOSCT-ND; Geometry.Height: 1.1mm; PCB DECAL: MMBT3906L; Order Number: MMBT3906LT1G; Part No: MMBT3906L
Q5 Q7 Q11-Q14 = MMBT3904,215: Transistor BJT NPN; Manufacturer_Name: Nexperia; Datasheet Link: https://assets.nexperia.com/documents/data-sheet/MMBT3904.pdf; Height: 1.1mm; Manufacturer_Part_Number: MMBT3904,215; Mouser Part Number: 771-MMBT3904T/R; Mouser Price/Stock: https://www.mouser.co.uk/ProductDetail/Nexperia/MMBT3904215?qs=LOCUfHb8d9s%2FW6hzAJGDbw%3D%3D; Arrow Part Number: MMBT3904,215; Arrow Price/Stock: https://www.arrow.com/en/products/mmbt3904215/nexperia?region=nac
Q6 = MMBT3906LT1H: Transistor BJT PNP; Manufacturer_Name: onsemi; Datasheet Link: https://www.mouser.in/datasheet/2/308/1/on_semiconductor_mmbt3906lt1_d-1195239.pdf; Height: 1.11mm; Manufacturer_Part_Number: MMBT3906LT1H; Mouser Part Number: 863-MMBT3906LT1H; Mouser Price/Stock: https://www.mouser.co.uk/ProductDetail/onsemi/MMBT3906LT1H?qs=kbSN2QblFfK%252B3Tf0dtu%2FeQ%3D%3D; Arrow Part Number: MMBT3906LT1H; Arrow Price/Stock: https://www.arrow.com/en/products/mmbt3906lt1h/on-semiconductor?region=nac
Q9 = FDC6327C: Integrated Circuit; Manufacturer_Name: onsemi; Datasheet Link: https://datasheet.datasheetarchive.com/originals/distributors/Datasheets_SAMA/e301740928fca84ccc639c023f90bb32.pdf; Height: 1.1mm; Manufacturer_Part_Number: FDC6327C; Mouser Part Number: 512-FDC6327C; Mouser Price/Stock: https://www.mouser.co.uk/ProductDetail/ON-Semiconductor-Fairchild/FDC6327C?qs=iN0KuJO79KYSwrsClcAPjw%3D%3D; Arrow Part Number: FDC6327C; Arrow Price/Stock: https://www.arrow.com/en/products/fdc6327c/on-semiconductor?region=nac
R17-R22 R28 R29 R117-R120 R123 R124 R194 R195 R197 R198 R248-R251 = RES: as R51 on sheet ChipSelects+Faults; PCB DECAL: CR0603N; Rated_Power: 1/10W; Tolerance: 1%; Package_Size: 0603
R121 R122 = RC0603FR-070RL: Resistor; Manufacturer_Name: YAGEO; Datasheet Link: https://componentsearchengine.com/Datasheets/2/RC0603FR-070RL.pdf; Height: 0.55mm; Manufacturer_Part_Number: RC0603FR-070RL; Mouser Part Number: 603-RC0603FR-070RL; Mouser Price/Stock: https://www.mouser.co.uk/ProductDetail/YAGEO/RC0603FR-070RL?qs=0yPvnVz5%2FmpDQv43TwvCfw%3D%3D; Arrow Part Number: RC0603FR-070RL; Arrow Price/Stock: https://www.arrow.com/en/products/rc0603fr-070rl/yageo?region=europe
R136 = RES: RES.,200 OHMS,1%,1/10W,0603; Manufacturer_PN: ERJ3EKF1002V; Manufacturer: PANASONIC; Part No: P10.0KHCT-ND; CLASS: DISCRETE; Temperature_Coefficient: 100ppm/C; FPLIST: CR0603N,CR0603L,CR0603M; Source_Path: \\MIL-NS1\CIP\SCHEMATIC_SYMBOLS\LTC_RESISTOR.OLB; Geometry.Height: 37.40mil; PCB DECAL: CR0603N; Rated_Power: 1/10W; Tolerance: 1%; Package_Size: 0603
U5 = MAX6639: Manufacturer: Maxim; Part No: MAX6639FAEE+; Geometry.Height: 1.73mm; Order No: 2515647; PCB DECAL: SOP63P602X173-16N

## Sheet iDAC1.SchDoc: Laser PCB
size A3; DrawnBy: James Singleton; Organization: TMC Technology Ltd.; DocumentNumber: 2; Revision: A; SheetNumber: 3; SheetTotal: 18; Drawn Date: 22/12/2020
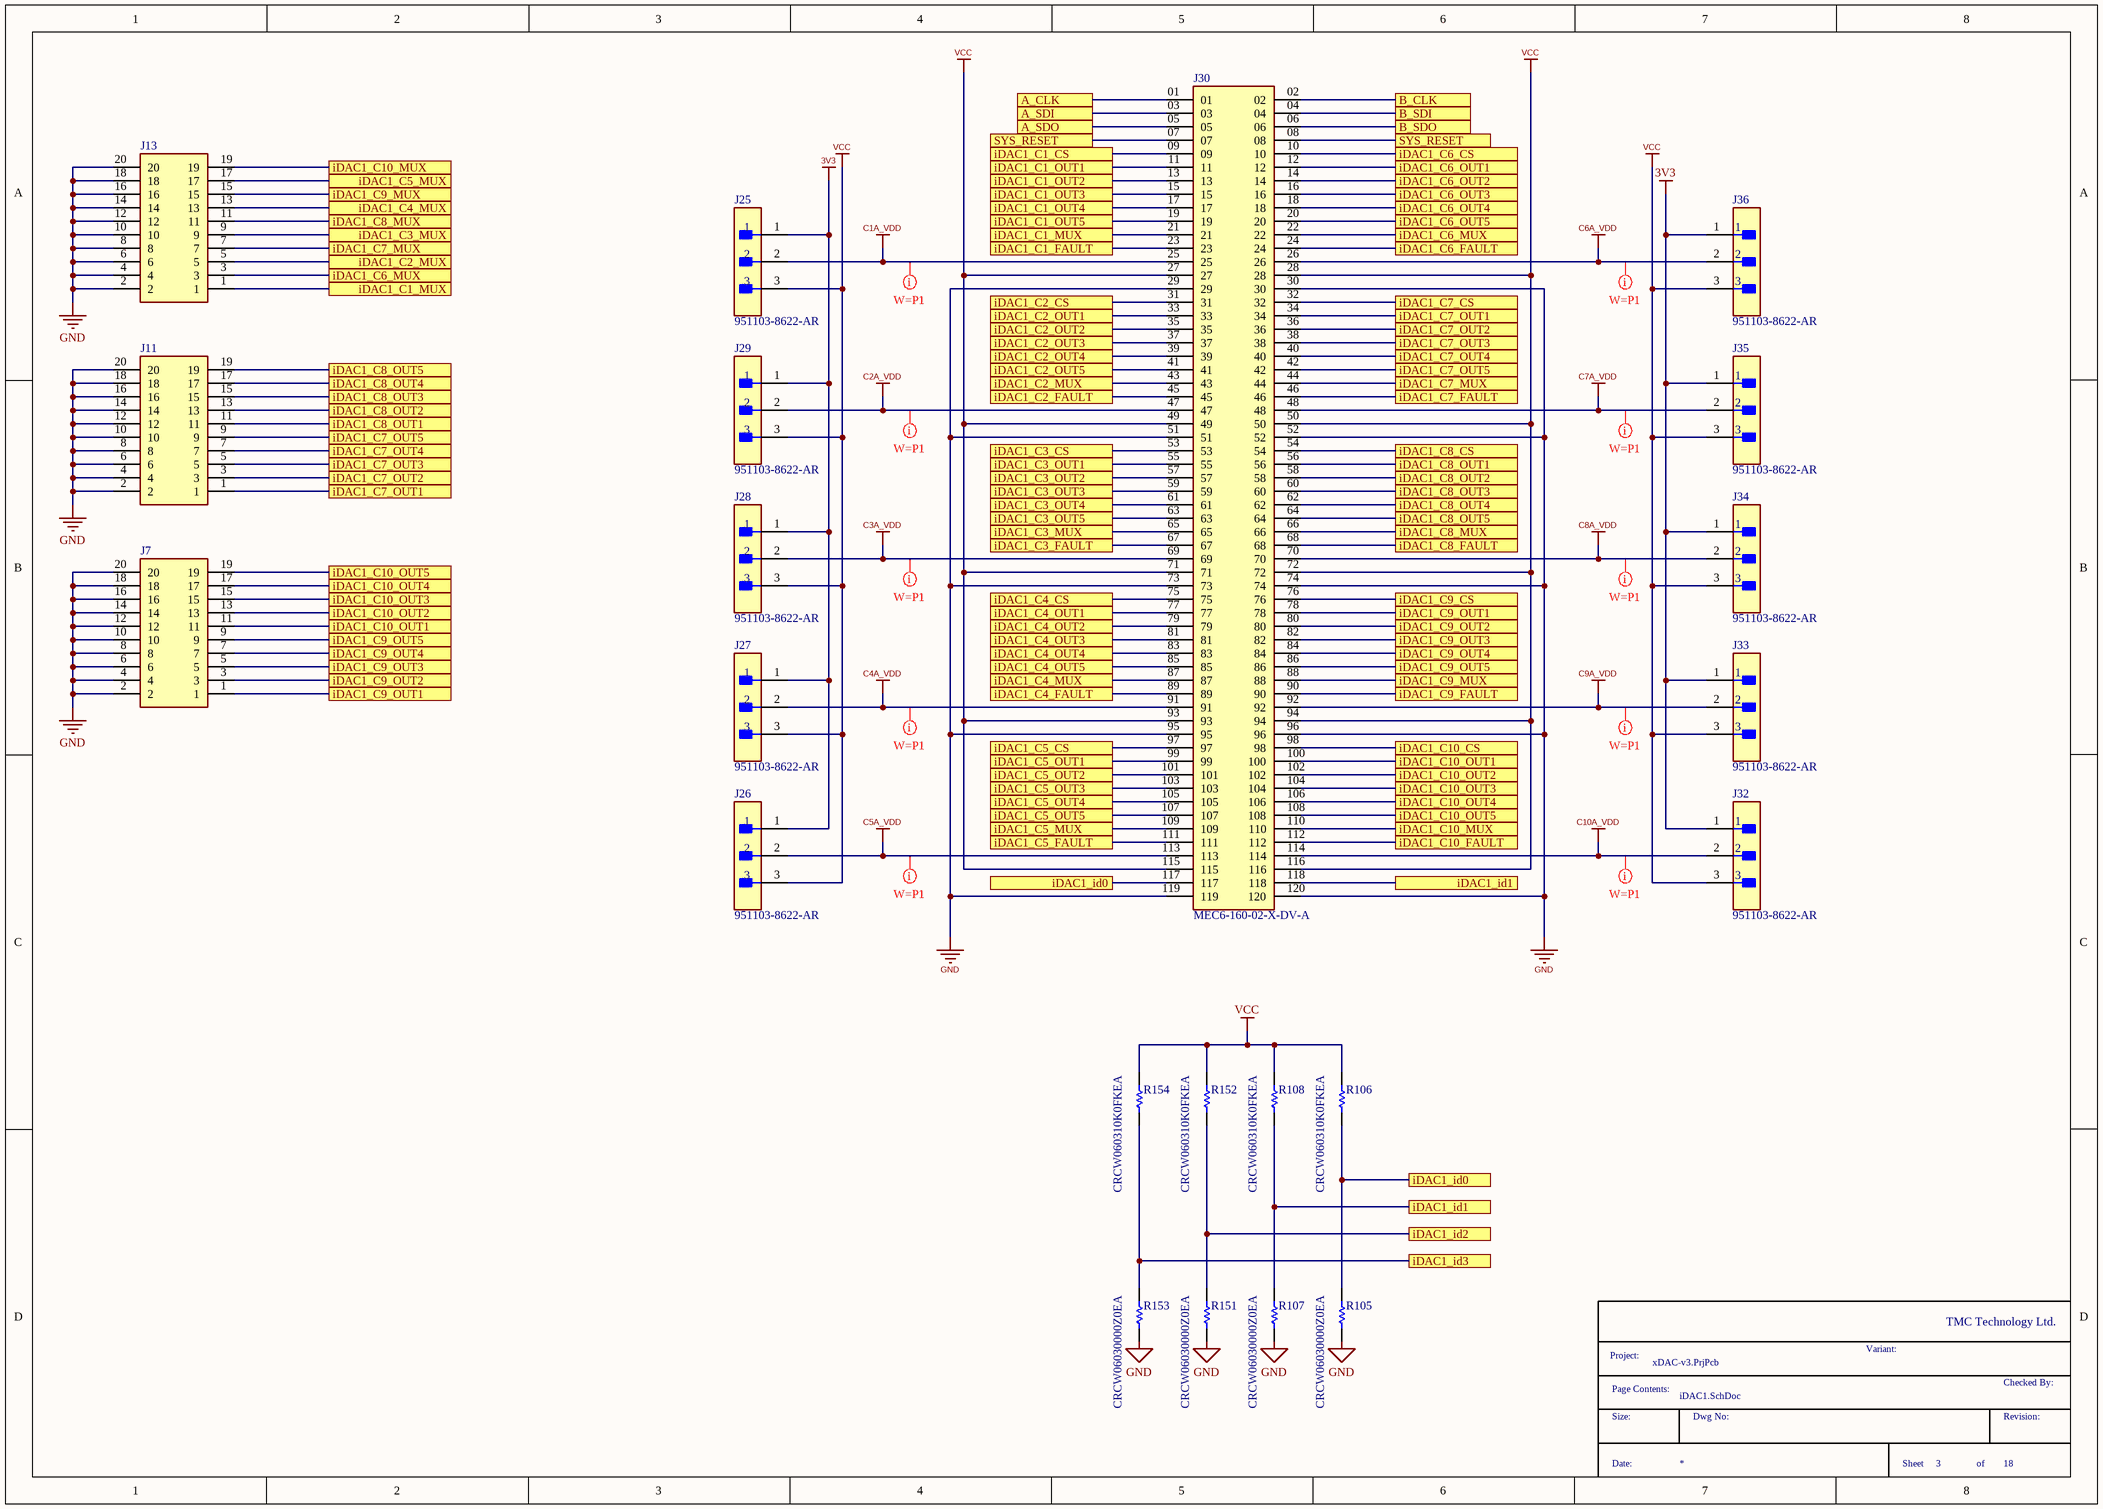
[diagram p3: iDAC1.SchDoc]

### Parts
J7  (no value)  [HDRV20W40P127_2X10_1270X340X550P]
J11  (no value)  [HDRV20W40P127_2X10_1270X340X550P]
J13  (no value)  [HDRV20W40P127_2X10_1270X340X550P]
J25  951103-8622-AR  [FP-951103-8622-AR-MFG]
J26  951103-8622-AR  [FP-951103-8622-AR-MFG]
J27  951103-8622-AR  [FP-951103-8622-AR-MFG]
J28  951103-8622-AR  [FP-951103-8622-AR-MFG]
J29  951103-8622-AR  [FP-951103-8622-AR-MFG]
J30  MEC6-160-02-X-DV-A  [SAMTEC_MEC6-160-02-X-DV-A]
J32  951103-8622-AR  [FP-951103-8622-AR-MFG]
J33  951103-8622-AR  [FP-951103-8622-AR-MFG]
J34  951103-8622-AR  [FP-951103-8622-AR-MFG]
J35  951103-8622-AR  [FP-951103-8622-AR-MFG]
J36  951103-8622-AR  [FP-951103-8622-AR-MFG]
R105  CRCW06030000Z0EA  [RESC1609X50X30NL8T20]
R106  CRCW060310K0FKEA  [RESC1609X50X30NL8T20]
R107  CRCW06030000Z0EA  [RESC1609X50X30NL8T20]
R108  CRCW060310K0FKEA  [RESC1609X50X30NL8T20]
R151  CRCW06030000Z0EA  [RESC1609X50X30NL8T20]
R152  CRCW060310K0FKEA  [RESC1609X50X30NL8T20]
R153  CRCW06030000Z0EA  [RESC1609X50X30NL8T20]
R154  CRCW060310K0FKEA  [RESC1609X50X30NL8T20]

### Ports
A_CLK (see iDAC2[4A], PI_INTERFACE[2B], vDAC1[4A], vDAC2[4A]), A_SDI (see iDAC2[4A], PI_INTERFACE[2B], vDAC1[4A], vDAC2[4A]), A_SDO (see iDAC2[4A], PI_INTERFACE[1B], vDAC1[4A], vDAC2[4A]), B_CLK (see iDAC2[6A], PI_INTERFACE[2B], vDAC1[5A], vDAC2[5A]), B_SDI (see iDAC2[6A], PI_INTERFACE[2B], vDAC1[5A], vDAC2[5A]), B_SDO (see iDAC2[6A], PI_INTERFACE[1B], vDAC1[5A], vDAC2[5A]), iDAC1_C1_CS (see ChipSelects+Faults[6A]), iDAC1_C1_FAULT (see ChipSelects+Faults[1A]), iDAC1_C1_MUX (see iDAC1[2A]), iDAC1_C1_MUX (see iDAC1[4A]), iDAC1_C1_OUT1 (see TX_FlexiConnectors[3A]), iDAC1_C1_OUT2 (see TX_FlexiConnectors[3A]), iDAC1_C1_OUT3 (see TX_FlexiConnectors[3A]), iDAC1_C1_OUT4 (see TX_FlexiConnectors[3A]), iDAC1_C1_OUT5 (see TX_FlexiConnectors[3A]), iDAC1_C2_CS (see ChipSelects+Faults[6A]), iDAC1_C2_FAULT (see ChipSelects+Faults[1A]), iDAC1_C2_MUX (see iDAC1[2A]), iDAC1_C2_MUX (see iDAC1[4B]), iDAC1_C2_OUT1 (see TX_FlexiConnectors[3A]), iDAC1_C2_OUT2 (see TX_FlexiConnectors[3A]), iDAC1_C2_OUT3 (see TX_FlexiConnectors[3A]), iDAC1_C2_OUT4 (see TX_FlexiConnectors[3A]), iDAC1_C2_OUT5 (see TX_FlexiConnectors[3B]), iDAC1_C3_CS (see ChipSelects+Faults[6B]), iDAC1_C3_FAULT (see ChipSelects+Faults[4B]), iDAC1_C3_MUX (see iDAC1[2A]), iDAC1_C3_MUX (see iDAC1[4B]), iDAC1_C3_OUT1 (see TX_FlexiConnectors[3B]), iDAC1_C3_OUT2 (see TX_FlexiConnectors[3C]), iDAC1_C3_OUT3 (see TX_FlexiConnectors[3C]), iDAC1_C3_OUT4 (see TX_FlexiConnectors[3C]), iDAC1_C3_OUT5 (see TX_FlexiConnectors[3C]), iDAC1_C4_CS (see ChipSelects+Faults[6B]), iDAC1_C4_FAULT (see ChipSelects+Faults[1B]), iDAC1_C4_MUX (see iDAC1[2A]), iDAC1_C4_MUX (see iDAC1[4B]), iDAC1_C4_OUT1 (see TX_FlexiConnectors[3C]), iDAC1_C4_OUT2 (see TX_FlexiConnectors[3C]), iDAC1_C4_OUT3 (see TX_FlexiConnectors[3C]), iDAC1_C4_OUT4 (see TX_FlexiConnectors[3C]), iDAC1_C4_OUT5 (see TX_FlexiConnectors[3C]), iDAC1_C5_CS (see ChipSelects+Faults[6B]), iDAC1_C5_FAULT (see ChipSelects+Faults[1B]), iDAC1_C5_MUX (see iDAC1[2A]), iDAC1_C5_MUX (see iDAC1[4C]), iDAC1_C5_OUT1 (see TX_FlexiConnectors[3C]), iDAC1_C5_OUT2 (see TX_FlexiConnectors[1C]), iDAC1_C5_OUT3 (see TX_FlexiConnectors[1C]), iDAC1_C5_OUT4 (see TX_FlexiConnectors[1C]), iDAC1_C5_OUT5 (see TX_FlexiConnectors[1C]), iDAC1_C6_CS (see ChipSelects+Faults[6B]), iDAC1_C6_FAULT (see ChipSelects+Faults[1B]), iDAC1_C6_MUX (see iDAC1[2A]), iDAC1_C6_MUX (see iDAC1[6A]), iDAC1_C6_OUT1 (see TX_FlexiConnectors[1C]), iDAC1_C6_OUT2 (see TX_FlexiConnectors[1C]), iDAC1_C6_OUT3 (see TX_FlexiConnectors[1C]), iDAC1_C6_OUT4 (see TX_FlexiConnectors[1B]), iDAC1_C6_OUT5 (see TX_FlexiConnectors[1B]), iDAC1_C7_CS (see ChipSelects+Faults[6B]), iDAC1_C7_FAULT (see ChipSelects+Faults[1B]), iDAC1_C7_MUX (see iDAC1[2A]), iDAC1_C7_MUX (see iDAC1[6B]), iDAC1_C7_OUT1 (see iDAC1[2B]), iDAC1_C7_OUT1 (see iDAC1[6A]), iDAC1_C7_OUT2 (see iDAC1[2B]), iDAC1_C7_OUT2 (see iDAC1[6A]), iDAC1_C7_OUT3 (see iDAC1[2B]), iDAC1_C7_OUT3 (see iDAC1[6A]), iDAC1_C7_OUT4 (see iDAC1[2B]), iDAC1_C7_OUT4 (see iDAC1[6A]), iDAC1_C7_OUT5 (see iDAC1[2B]), iDAC1_C7_OUT5 (see iDAC1[6A]), iDAC1_C8_CS (see ChipSelects+Faults[6B]), iDAC1_C8_FAULT (see ChipSelects+Faults[1B]), iDAC1_C8_MUX (see iDAC1[2A]), iDAC1_C8_MUX (see iDAC1[6B]), iDAC1_C8_OUT1 (see iDAC1[2B]), iDAC1_C8_OUT1 (see iDAC1[6B]), iDAC1_C8_OUT2 (see iDAC1[2B]), iDAC1_C8_OUT2 (see iDAC1[6B]), iDAC1_C8_OUT3 (see iDAC1[2B]), iDAC1_C8_OUT3 (see iDAC1[6B]), iDAC1_C8_OUT4 (see iDAC1[2B]), iDAC1_C8_OUT4 (see iDAC1[6B]), iDAC1_C8_OUT5 (see iDAC1[2A]), iDAC1_C8_OUT5 (see iDAC1[6B]), iDAC1_C9_CS (see ChipSelects+Faults[6B]), iDAC1_C9_FAULT (see ChipSelects+Faults[1B]), iDAC1_C9_MUX (see iDAC1[2A]), iDAC1_C9_MUX (see iDAC1[6B]), iDAC1_C9_OUT1 (see iDAC1[2B]), iDAC1_C9_OUT1 (see iDAC1[6B]), iDAC1_C9_OUT2 (see iDAC1[2B]), iDAC1_C9_OUT2 (see iDAC1[6B]), iDAC1_C9_OUT3 (see iDAC1[2B]), iDAC1_C9_OUT3 (see iDAC1[6B]), iDAC1_C9_OUT4 (see iDAC1[2B]), iDAC1_C9_OUT4 (see iDAC1[6B]), iDAC1_C9_OUT5 (see iDAC1[2B]), iDAC1_C9_OUT5 (see iDAC1[6B]), iDAC1_C10_CS (see ChipSelects+Faults[6B]), iDAC1_C10_FAULT (see ChipSelects+Faults[1B]), iDAC1_C10_MUX (see iDAC1[2A]), iDAC1_C10_MUX (see iDAC1[6C]), iDAC1_C10_OUT1 (see iDAC1[2B]), iDAC1_C10_OUT1 (see iDAC1[6C]), iDAC1_C10_OUT2 (see iDAC1[2B]), iDAC1_C10_OUT2 (see iDAC1[6C]), iDAC1_C10_OUT3 (see iDAC1[2B]), iDAC1_C10_OUT3 (see iDAC1[6C]), iDAC1_C10_OUT4 (see iDAC1[2B]), iDAC1_C10_OUT4 (see iDAC1[6C]), iDAC1_C10_OUT5 (see iDAC1[2B]), iDAC1_C10_OUT5 (see iDAC1[6C]), iDAC1_id0 (see ChipSelects+Faults[1C], iDAC1[4C]), iDAC1_id0 (see ChipSelects+Faults[1C], iDAC1[6D]), iDAC1_id1 (see iDAC1[6C]), iDAC1_id1 (see iDAC1[6D]), iDAC1_id2, iDAC1_id3, SYS_RESET (see iDAC1[4A], iDAC2[4A], iDAC2[6A], PI_INTERFACE[1C], PIO[5A], PIO[5D], PIO[7B], PIO[7C], vDAC1[4A], vDAC1[5A], vDAC2[3A], vDAC2[5A]), SYS_RESET (see iDAC1[6A], iDAC2[4A], iDAC2[6A], PI_INTERFACE[1C], PIO[5A], PIO[5D], PIO[7B], PIO[7C], vDAC1[4A], vDAC1[5A], vDAC2[3A], vDAC2[5A])

### Nets
3V3: J25.1 J26.1 J27.1 J28.1 J29.1 J32.1 J33.1 J34.1 J35.1 J36.1
C1A_VDD: J25.2 J30.25
C2A_VDD: J29.2 J30.47
C3A_VDD: J28.2 J30.69
C4A_VDD: J27.2 J30.91
C5A_VDD: J26.2 J30.113
C6A_VDD: J30.26 J36.2
C7A_VDD: J30.48 J35.2
C8A_VDD: J30.70 J34.2
C9A_VDD: J30.92 J33.2
C10A_VDD: J30.114 J32.2
GND: J7.2 J7.4 J7.6 J7.8 J7.10 J7.12 J7.14 J7.16 J7.18 J7.20 J11.2 J11.4 J11.6 J11.8 J11.10 J11.12 J11.14 J11.16 J11.18 J11.20 J13.2 J13.4 J13.6 J13.8 J13.10 J13.12 J13.14 J13.16 J13.18 J13.20 J30.29 J30.30 J30.51 J30.52 J30.73 J30.74 J30.95 J30.96 J30.119 J30.120 R105.1 R107.1 R151.1 R153.1
VCC: J25.3 J26.3 J27.3 J28.3 J29.3 J30.27 J30.28 J30.49 J30.50 J30.71 J30.72 J30.93 J30.94 J30.115 J30.116 J32.3 J33.3 J34.3 J35.3 J36.3 R106.2 R108.2 R152.2 R154.2
A_CLK: J30.01 ; port A_CLK
A_SDI: J30.03 ; port A_SDI
A_SDO: J30.05 ; port A_SDO
B_CLK: J30.02 ; port B_CLK
B_SDI: J30.04 ; port B_SDI
B_SDO: J30.06 ; port B_SDO
iDAC1_C1_CS: J30.09 ; port iDAC1_C1_CS
iDAC1_C1_FAULT: J30.23 ; port iDAC1_C1_FAULT
iDAC1_C1_MUX: J13.1 J30.21 ; port iDAC1_C1_MUX
iDAC1_C1_OUT1: J30.11 ; port iDAC1_C1_OUT1
iDAC1_C1_OUT2: J30.13 ; port iDAC1_C1_OUT2
iDAC1_C1_OUT3: J30.15 ; port iDAC1_C1_OUT3
iDAC1_C1_OUT4: J30.17 ; port iDAC1_C1_OUT4
iDAC1_C1_OUT5: J30.19 ; port iDAC1_C1_OUT5
iDAC1_C2_CS: J30.31 ; port iDAC1_C2_CS
iDAC1_C2_FAULT: J30.45 ; port iDAC1_C2_FAULT
iDAC1_C2_MUX: J13.5 J30.43 ; port iDAC1_C2_MUX
iDAC1_C2_OUT1: J30.33 ; port iDAC1_C2_OUT1
iDAC1_C2_OUT2: J30.35 ; port iDAC1_C2_OUT2
iDAC1_C2_OUT3: J30.37 ; port iDAC1_C2_OUT3
iDAC1_C2_OUT4: J30.39 ; port iDAC1_C2_OUT4
iDAC1_C2_OUT5: J30.41 ; port iDAC1_C2_OUT5
iDAC1_C3_CS: J30.53 ; port iDAC1_C3_CS
iDAC1_C3_FAULT: J30.67 ; port iDAC1_C3_FAULT
iDAC1_C3_MUX: J13.9 J30.65 ; port iDAC1_C3_MUX
iDAC1_C3_OUT1: J30.55 ; port iDAC1_C3_OUT1
iDAC1_C3_OUT2: J30.57 ; port iDAC1_C3_OUT2
iDAC1_C3_OUT3: J30.59 ; port iDAC1_C3_OUT3
iDAC1_C3_OUT4: J30.61 ; port iDAC1_C3_OUT4
iDAC1_C3_OUT5: J30.63 ; port iDAC1_C3_OUT5
iDAC1_C4_CS: J30.75 ; port iDAC1_C4_CS
iDAC1_C4_FAULT: J30.89 ; port iDAC1_C4_FAULT
iDAC1_C4_MUX: J13.13 J30.87 ; port iDAC1_C4_MUX
iDAC1_C4_OUT1: J30.77 ; port iDAC1_C4_OUT1
iDAC1_C4_OUT2: J30.79 ; port iDAC1_C4_OUT2
iDAC1_C4_OUT3: J30.81 ; port iDAC1_C4_OUT3
iDAC1_C4_OUT4: J30.83 ; port iDAC1_C4_OUT4
iDAC1_C4_OUT5: J30.85 ; port iDAC1_C4_OUT5
iDAC1_C5_CS: J30.97 ; port iDAC1_C5_CS
iDAC1_C5_FAULT: J30.111 ; port iDAC1_C5_FAULT
iDAC1_C5_MUX: J13.17 J30.109 ; port iDAC1_C5_MUX
iDAC1_C5_OUT1: J30.99 ; port iDAC1_C5_OUT1
iDAC1_C5_OUT2: J30.101 ; port iDAC1_C5_OUT2
iDAC1_C5_OUT3: J30.103 ; port iDAC1_C5_OUT3
iDAC1_C5_OUT4: J30.105 ; port iDAC1_C5_OUT4
iDAC1_C5_OUT5: J30.107 ; port iDAC1_C5_OUT5
iDAC1_C6_CS: J30.10 ; port iDAC1_C6_CS
iDAC1_C6_FAULT: J30.24 ; port iDAC1_C6_FAULT
iDAC1_C6_MUX: J13.3 J30.22 ; port iDAC1_C6_MUX
iDAC1_C6_OUT1: J30.12 ; port iDAC1_C6_OUT1
iDAC1_C6_OUT2: J30.14 ; port iDAC1_C6_OUT2
iDAC1_C6_OUT3: J30.16 ; port iDAC1_C6_OUT3
iDAC1_C6_OUT4: J30.18 ; port iDAC1_C6_OUT4
iDAC1_C6_OUT5: J30.20 ; port iDAC1_C6_OUT5
iDAC1_C7_CS: J30.32 ; port iDAC1_C7_CS
iDAC1_C7_FAULT: J30.46 ; port iDAC1_C7_FAULT
iDAC1_C7_MUX: J13.7 J30.44 ; port iDAC1_C7_MUX
iDAC1_C7_OUT1: J11.1 J30.34 ; port iDAC1_C7_OUT1
iDAC1_C7_OUT2: J11.3 J30.36 ; port iDAC1_C7_OUT2
iDAC1_C7_OUT3: J11.5 J30.38 ; port iDAC1_C7_OUT3
iDAC1_C7_OUT4: J11.7 J30.40 ; port iDAC1_C7_OUT4
iDAC1_C7_OUT5: J11.9 J30.42 ; port iDAC1_C7_OUT5
iDAC1_C8_CS: J30.54 ; port iDAC1_C8_CS
iDAC1_C8_FAULT: J30.68 ; port iDAC1_C8_FAULT
iDAC1_C8_MUX: J13.11 J30.66 ; port iDAC1_C8_MUX
iDAC1_C8_OUT1: J11.11 J30.56 ; port iDAC1_C8_OUT1
iDAC1_C8_OUT2: J11.13 J30.58 ; port iDAC1_C8_OUT2
iDAC1_C8_OUT3: J11.15 J30.60 ; port iDAC1_C8_OUT3
iDAC1_C8_OUT4: J11.17 J30.62 ; port iDAC1_C8_OUT4
iDAC1_C8_OUT5: J11.19 J30.64 ; port iDAC1_C8_OUT5
iDAC1_C9_CS: J30.76 ; port iDAC1_C9_CS
iDAC1_C9_FAULT: J30.90 ; port iDAC1_C9_FAULT
iDAC1_C9_MUX: J13.15 J30.88 ; port iDAC1_C9_MUX
iDAC1_C9_OUT1: J7.1 J30.78 ; port iDAC1_C9_OUT1
iDAC1_C9_OUT2: J7.3 J30.80 ; port iDAC1_C9_OUT2
iDAC1_C9_OUT3: J7.5 J30.82 ; port iDAC1_C9_OUT3
iDAC1_C9_OUT4: J7.7 J30.84 ; port iDAC1_C9_OUT4
iDAC1_C9_OUT5: J7.9 J30.86 ; port iDAC1_C9_OUT5
iDAC1_C10_CS: J30.98 ; port iDAC1_C10_CS
iDAC1_C10_FAULT: J30.112 ; port iDAC1_C10_FAULT
iDAC1_C10_MUX: J13.19 J30.110 ; port iDAC1_C10_MUX
iDAC1_C10_OUT1: J7.11 J30.100 ; port iDAC1_C10_OUT1
iDAC1_C10_OUT2: J7.13 J30.102 ; port iDAC1_C10_OUT2
iDAC1_C10_OUT3: J7.15 J30.104 ; port iDAC1_C10_OUT3
iDAC1_C10_OUT4: J7.17 J30.106 ; port iDAC1_C10_OUT4
iDAC1_C10_OUT5: J7.19 J30.108 ; port iDAC1_C10_OUT5
iDAC1_id0: J30.117 R105.2 R106.1 ; port iDAC1_id0
iDAC1_id1: J30.118 R107.2 R108.1 ; port iDAC1_id1
iDAC1_id2: R151.2 R152.1 ; port iDAC1_id2
iDAC1_id3: R153.2 R154.1 ; port iDAC1_id3
SYS_RESET: J30.07 J30.08 ; port SYS_RESET

### Layout directives
net class PowerOne: C1A_VDD
mark named W=P1: C2A_VDD, C3A_VDD, C4A_VDD, C5A_VDD, C6A_VDD, C7A_VDD, C8A_VDD, C9A_VDD, C10A_VDD

### Notes on the sheet
- TMC Technology Ltd.
- Page Contents:
- Project:
- Variant:
- Checked By:
- Size:
- Date:
- Dwg No:
- Sheet
- of
- Revision:

### Library data of the parts
J7 J11 J13 = 20021111-00020T4LF: Connector; Manufacturer_Name: FCI Electronics; Datasheet Link: https://media.digikey.com/pdf/Data%20Sheets/FCI%20PDFs/Minitek%20127_Catalog.pdf; Height: 5.5mm; Manufacturer_Part_Number: 20021111-00020T4LF
J25-J29 J32-J36 = CMP-05379-000003-1: CONN HEADER VERT 3POS 2MM; Manufacturer: 3M; Conn Gender: Male; Current Rating: 2A; Number Of Contacts: 3; Conn Orientation: Straight; Height: 6.3mm; Digikey Description: CONN HEADER VERT 3POS 2MM; Device Class L3: unset; Category: Conn; Manufacturer Part Number: 951103-8622-AR; RoHS: TRUE; Contact Material: Gold,Nickel; ComponentLink2Description: Datasheet; Temperature Range Low: -55°C; Device Class L1: Connectors; Pitch: 2mm; Mouser Description: Header; PinStrip; CopperAlloy; HighTempThermoplastic; 3Cnts; 1A; RtAngle; 951Series; Octopart: https://octopart.com/951103-8622-ar-3m-14400669; Package: 951103-8622-AR; Lead Free: Yes; Device Class L2: Headers and Wire Housings; Temperature Range High: +125°C; ComponentLink2URL: http://multimedia.3m.com/mws/media/1400506O/3m-pin-strip-header-951-series-78-5100-2653-3.pdf; Automotive: No; Temperature: -55°C to +125°C; Number Of Rows: 1
J30 = MEC6-160-02-X-DV-A: MF: Samtec Inc.; System: Connector; Value: *; Price: None; Package: None; Availability: Unavailable; MP: MEC6-160-02-X-DV-A
R105 R107 R151 R153 = CMP-2000-03816-5: Chip Resistor, 0 Ohm, Jumper, 100 mW, -55 to 155 degC, 0603 (1608 Metric), RoHS, Tape and Reel; Manufacturer: Vishay Semiconductor; Voltage Rating: 75 V; Package Quantity: 5000; DatasheetVersion: 06/2012; Min Operating Temperature: -55 degC; ComponentLink1URL: http://www.vishay.com/; Mounting Technology: Surface Mount; Height: 0.45 mm; ComponentLink1Description: Manufacturer URL; REACH SVHC: Unknown; PackageReference: 0603; Packaging: Tape and Reel; Max Operating Temperature: 155 degC; Mount: Surface Mount; ComponentLink2Description: Datasheet; PackageDescription: 2-Pin Surface Mount Device, Body 1.575 x 0.85 mm; Length: 1.55 mm; ComponentLink2URL: http://www.vishay.com/docs/20035/dcrcwe3.pdf; Pins: 2; RoHSCompliant: true
R106 R108 R152 R154 = CMP-1666-00005-4: Chip Resistor, 10 KOhm, +/- 1%, 100 mW, -55 to 155 degC, 0603 (1608 Metric), RoHS, Tape and Reel; Manufacturer: Vishay Semiconductor; Voltage Rating: 75 V; Max Operating Temperature: 155 degC; PackageDescription: 2-Pin Surface Mount Device, Body 1.575 x 0.85 mm; ComponentLink1Description: Manufacturer URL; RoHSCompliant: true; PackageReference: 0603; REACH SVHC: Unknown; Length: 1.55 mm; DatasheetVersion: 06/2012; Packaging: Tape and Reel; Min Operating Temperature: -55 degC; Mounting Technology: Surface Mount; ComponentLink2URL: https://datasheet.ciiva.com/11809/0900766b80d98afc-11809037.pdf; Height: 0.45 mm; ComponentLink2Description: Datasheet; Package Quantity: 5000; ComponentLink1URL: http://www.vishay.com/